# Altium project uz_d_iepe.PrjPCB (part 2 of 3)

## Sheet Power_3.SchDoc
size A4; CompanyName: TH Nürnberg; Organization: UltraZohm; Address1: Kesslerplatz 12; Address2: 90489 Nürnberg; Address3: GERMANY; SheetNumber: 7; SheetTotal: 10
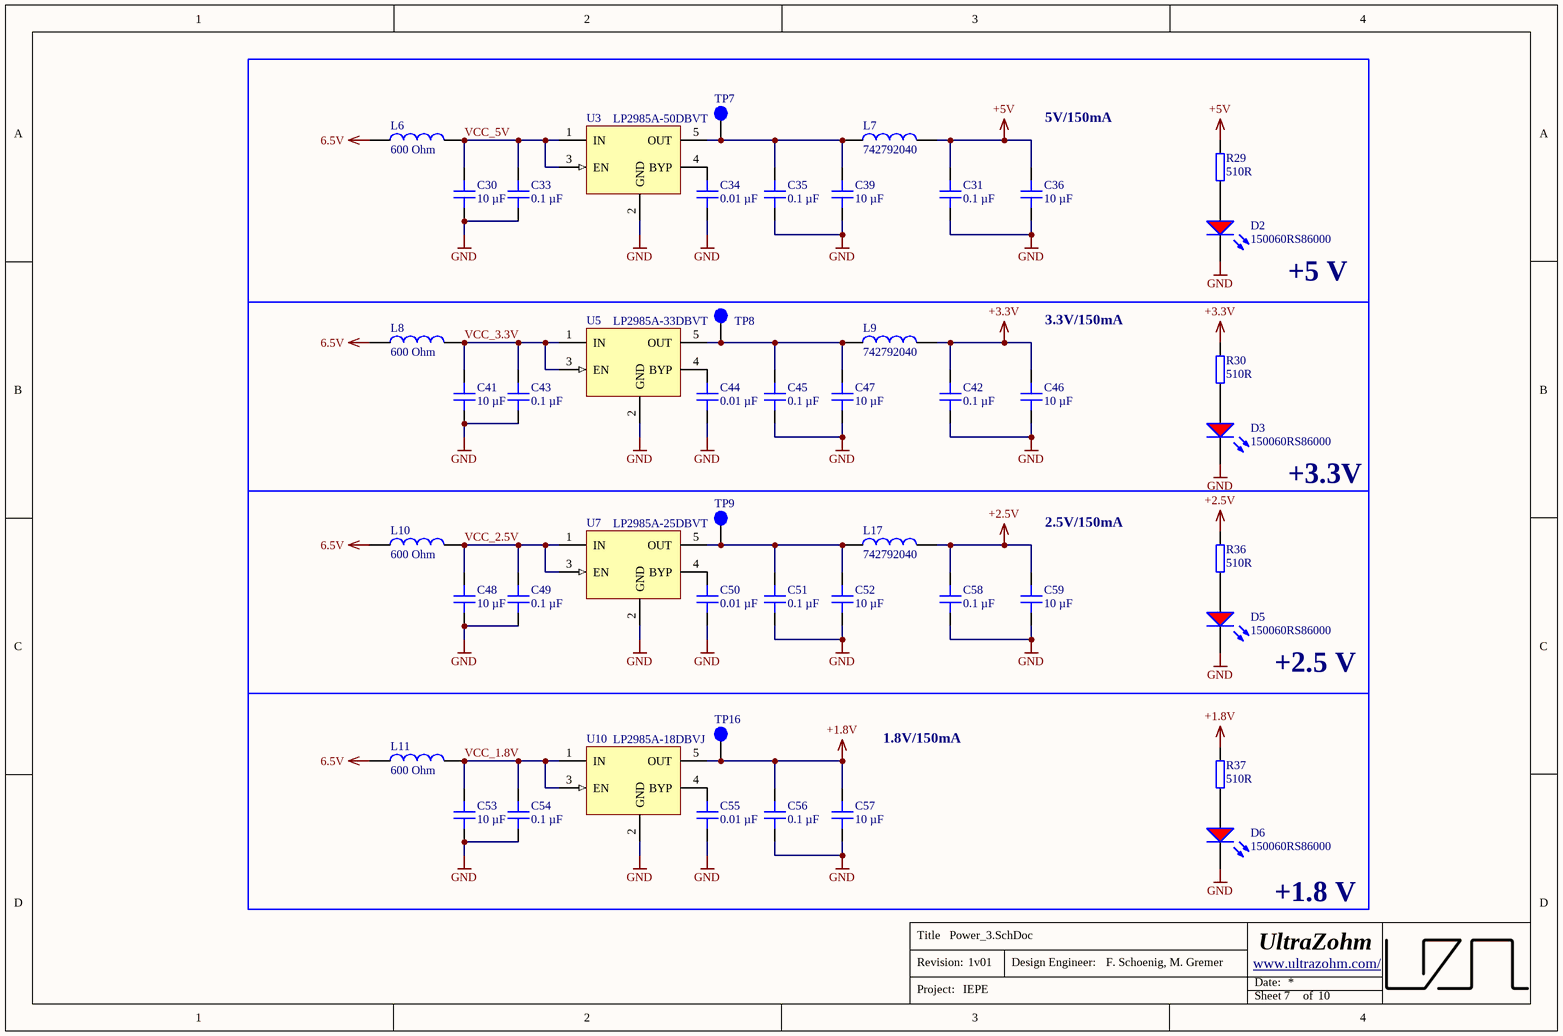
[diagram p5: Power_3.SchDoc]

### Parts
(Parts that share a designator on the sheet are numbered #1, #2 ... from top to bottom, then left to right.)
C30  10 µF  [C_1206]
C31  0.1 µF  [C_0603]
C33  0.1 µF  [C_0603]
C34  0.01 µF  [C_0603]
C35  0.1 µF  [C_0603]
C36  10 µF  [C_1206]
C39  10 µF  [C_1206]
C41  10 µF  [C_1206]
C42  0.1 µF  [C_0603]
C43  0.1 µF  [C_0603]
C44  0.01 µF  [C_0603]
C45  0.1 µF  [C_0603]
C46  10 µF  [C_1206]
C47  10 µF  [C_1206]
C48  10 µF  [C_1206]
C49  0.1 µF  [C_0603]
C50  0.01 µF  [C_0603]
C51  0.1 µF  [C_0603]
C52  10 µF  [C_1206]
C53  10 µF  [C_1206]
C54  0.1 µF  [C_0603]
C55  0.01 µF  [C_0603]
C56  0.1 µF  [C_0603]
C57  10 µF  [C_1206]
C58  0.1 µF  [C_0603]
C59  10 µF  [C_1206]
D2  150060RS86000  [WL-SMCW_0603]
D3  150060RS86000  [WL-SMCW_0603]
D5  150060RS86000  [WL-SMCW_0603]
D6  150060RS86000  [WL-SMCW_0603]
L6  600 Ohm  [WE-CBF_0805_High Current]
L7  742792040  [WE-CBF_0805_High Current]
L8  600 Ohm  [WE-CBF_0805_High Current]
L9  742792040  [WE-CBF_0805_High Current]
L10  600 Ohm  [WE-CBF_0805_High Current]
L11  600 Ohm  [WE-CBF_0805_High Current]
L17  742792040  [WE-CBF_0805_High Current]
R29  510R  [RES 0603_1608]
R30  510R  [RES 0603_1608]
R36  510R  [RES 0603_1608]
R37  510R  [RES 0603_1608]
TP7  -  [TP_1mm]  (value not drawn)
TP8  -  [TP_1mm]  (value not drawn)
TP9  -  [TP_1mm]  (value not drawn)
TP16  -  [TP_1mm]  (value not drawn)
U3#2  LP2985A-50DBVT  [SOT95P250X110-5N]
U5  LP2985A-33DBVT  [SOT95P250X110-5N]
U7  LP2985A-25DBVT  [SOT95P250X110-5N]
U10  LP2985A-18DBVJ  [SOT95P250X110-5N]

### Blocks framed on the sheet
+5 V: C30 C31 C33-C36 C39 D2 L6 L7 R29 TP7 U3#2

### Nets
6.5V: L6.1 L8.1 L10.1 L11.1
+1.8V: C56.2 C57.2 R37.2 TP16.1 U10.5(OUT)
+2.5V: C58.2 C59.2 L17.2 R36.2
+3.3V: C42.2 C46.2 L9.2 R30.2
+5V: C31.2 C36.2 L7.2 R29.2
GND: C30.1 C31.1 C33.1 C34.1 C35.1 C36.1 C39.1 C41.1 C42.1 C43.1 C44.1 C45.1 C46.1 C47.1 C48.1 C49.1 C50.1 C51.1 C52.1 C53.1 C54.1 C55.1 C56.1 C57.1 C58.1 C59.1 D2.1(K) D3.1(K) D5.1(K) D6.1(K) U3#2.2(GND) U5.2(GND) U7.2(GND) U10.2(GND)
VCC_1.8V: C53.2 C54.2 L11.2 U10.1(IN) U10.3(EN)
VCC_2.5V: C48.2 C49.2 L10.2 U7.1(IN) U7.3(EN)
VCC_3.3V: C41.2 C43.2 L8.2 U5.1(IN) U5.3(EN)
VCC_5V: C30.2 C33.2 L6.2 U3#2.1(IN) U3#2.3(EN)
NetC34_2: C34.2 U3#2.4(BYP)
NetC35_2: C35.2 C39.2 L7.1 TP7.1 U3#2.5(OUT)
NetC44_2: C44.2 U5.4(BYP)
NetC45_2: C45.2 C47.2 L9.1 TP8.1 U5.5(OUT)
NetC50_2: C50.2 U7.4(BYP)
NetC51_2: C51.2 C52.2 L17.1 TP9.1 U7.5(OUT)
NetC55_2: C55.2 U10.4(BYP)
NetD2_2: D2.2(A) R29.1
NetD3_2: D3.2(A) R30.1
NetD5_2: D5.2(A) R36.1
NetD6_2: D6.2(A) R37.1

### Notes on the sheet
- 5V/150mA
- 3.3V/150mA
- +3.3V
- 2.5V/150mA
- +2.5 V
- 1.8V/150mA
- +1.8 V
- Title
- Revision:
- Design Engineer:
- Date:
- Project:
- Sheet
- of

### Library data of the parts
C30 C36 C39 C41 C46-C48 C52 C53 C57 C59 = C1206C106J3RACAUTO: Capacitor 1206, 25 VDC, 10 µF, X7R; Manufacturer: KEMET; Tolerance: 5 %; Voltage Rating: 25 VDC; Created from: MGremer; Manufacturer Part Number: C1206C106J3RACAUTO; PartID: 24; Created On: 20.12.2020 13:54:13; ComponentLink1Description: Datasheet; ComponentLink1URL: https://www.mouser.de/datasheet/2/212/KEM_C1023_X7R_AUTO_SMD-1093309.pdf; Component Type: Capacitor 1206; Device Package: 1206; Last Updated: 20.12.2020 16:34:30; Mounting Type: SMD; Operating Temperature: -55 - 125°C; Series: SMD Auto X7R; Supplier 1: Mouser; Supplier Part Number 1: 80-C1206C106J3RAUTO; Type: Capacitor; Value: 10 µF; Live Cycle Status: 1; Stock number: Labor SMD Container
C31 C33 C35 C42 C43 C45 C49 C51 C54 C56 C58 = C0603X104K5RAC7411: Capacitor 0603, 50 VDC, 0.1 µF, X7R; Manufacturer: KEMET; Tolerance: 10 %; Voltage Rating: 50 VDC; Created from: MGremer; Manufacturer Part Number: C0603X104K5RAC7411; PartID: 3; Created On: 20.12.2020 13:54:13; ComponentLink1Description: Datasheet; ComponentLink1URL: https://www.mouser.de/datasheet/2/212/1/KEM_C1013_X7R_FT_CAP_SMD-1103280.pdf; Component Type: Capacitor 0603; Device Package: 0603; Last Updated: 04.03.2021 09:24:28; Mounting Type: SMD; Operating Temperature: -55 - 125°C; Series: SMD Comm X7R Flex; Supplier 1: Mouser; Supplier Part Number 1: 80-C0603X104K5R7411; Supplier 2: LCSC; Supplier Part Number 2: C14663; Type: Capacitor; Value: 0.1 µF; Live Cycle Status: 1; LCSC Part Number: C14663; Stock number: Labor SMD Container
C34 C44 C50 C55 = GCJ188R71H103KA01D: Capacitor 0603, 50 VDC, 0.01 µF, X7R; Manufacturer: muRata; Tolerance: 10 %; Voltage Rating: 50 VDC; Created from: MGremer; Manufacturer Part Number: GCJ188R71H103KA01D; PartID: 1; Created On: 20.12.2020 13:54:13; ComponentLink1Description: Datasheet; ComponentLink1URL: https://www.mouser.de/datasheet/2/281/c03e-516224.pdf; Component Type: Capacitor 0603; Device Package: 0603; Last Updated: 20.12.2020 16:24:16; Mounting Type: SMD; Operating Temperature: -55 - 125°C; Series: GCJ; Supplier 1: Mouser; Supplier Part Number 1: 81-GCJ188R71H103KA1D; Type: Capacitor; Value: 0.01 µF; Live Cycle Status: 1; Stock number: Labor SMD Container
D2 D3 D5 D6 = 150060RS86000: WL-SMCW SMD Mono-color Chip LED Waterclear Red; Manufacturer: Wuerth Elektronik; Type: Standard; Created from: MGremer; Forward Current I_f: 20 mA; Forward Voltage U_f: 2 V; Wavelength: 624 nm; Light Intensity: 800 mcd; Nominal Power: 48 mW; Manufacturer Part Number: 150060RS86000; PartID: 3; Created On: 08.12.2020 10:48:12; ComponentLink1Description: Datasheet; ComponentLink1URL: https://www.mouser.de/datasheet/2/445/150120RS75000-1714636.pdf; Component Type: LED Diode; Device Package: 0603; Last Updated: 03.03.2021 09:59:52; Mounting Type: SMD; Operating Temperature: -40 - 85 °C; Supplier 1: Mouser; Supplier Part Number 1: 710-150060RS86000; Supplier 2: Farnell; Supplier Part Number 2: 3408608; Supplier 3: Digi-Key; Supplier Part Number 3: 732-150060RS86000CT-ND; Live Cycle Status: 1; Stock number: not stored; Color: red
L6 L8 L10 L11 = 742792040: Inductance, 0805, 100 MHz, 600 Ohm, 2 A; Manufacturer: Wurth Elektronik; Type: Inductance SMD; DC current: 2 A; Created from: MGremer; Manufacturer Part Number: 742792040; PartID: 1; Created On: 18.01.2021 14:53:17; ComponentLink1Description: Datasheet; ComponentLink1URL: https://www.mouser.de/datasheet/2/445/742792040-1720361.pdf; Component Type: Inductance; Device Package: 0805; Last Updated: 18.01.2021 14:53:25; Mounting Type: SMD; Operating Temperature: -55 - 125 °C; Series: WE-CBF; Supplier 1: Mouser; Supplier Part Number 1: 710-742792040; Value: 600 Ohm; Live Cycle Status: 1; Stock number: not stored
L7 L9 L17 = 742792040: Inductance, 0805, 100 MHz, 600 Ohm, 2 A; Manufacturer: Wurth Elektronik; Type: Inductance SMD; DC current: 2 A; Value: 600 Ohm; Created from: MGremer; Manufacturer Part Number: 742792040; PartID: 1; Created On: 18.01.2021 14:53:17; ComponentLink1Description: Datasheet; ComponentLink1URL: https://www.mouser.de/datasheet/2/445/742792040-1720361.pdf; Component Type: Inductance; Device Package: 0805; Last Updated: 18.01.2021 14:53:25; Mounting Type: SMD; Operating Temperature: -55 - 125 °C; Series: WE-CBF; Supplier 1: Mouser; Supplier Part Number 1: 710-742792040; Live Cycle Status: 1; Stock number: not stored
R29 R30 R36 R37 = RK73B1JTTD511J: SMD resistor E24 series; Manufacturer: KOA Speer; Tolerance: 5%; Created from: MGremer; Manufacturer Part Number: RK73B1JTTD511J; PartID: 67; Created On: 14.12.2020 16:17:14; ComponentLink1Description: Datasheet; ComponentLink1URL: https://www.mouser.de/datasheet/2/219/RK73B-1825463.pdf; Component Type: SMD resistor; Device Package: 0603; Last Updated: 02.03.2021 14:07:32; Mounting Type: SMD; Supplier 1: Mouser; Supplier Part Number 1: 660-RK73B1JTTD511J; Type: Resistor; Value: 510R; Live Cycle Status: 1; Stock number: Labor SMD Container
TP7-TP9 TP16 = -: Test Point 1 mm; Value: TP; Created from: MGremer; Created: 2018_06_25_AGeiger; Manufacturer Part Number: -; PartID: 9; Created On: 02.03.2021 14:59:37; ComponentLink1Description: Datasheet; ComponentLink1URL: -; ComponentLink2Description: Homepage; ComponentLink2URL: -; Component Type: Test Point; Device Package: SMD; Last Updated: 08.10.2021 21:16:06; Manufacturer: -; Minimum Order: 1; Mounting Type: SMD; Supplier 1: -; Supplier Part Number 1: -; Type: Test point; Live Cycle Status: 1; Stock number: not stored
U3#2 = LP2985A-50DBVT: 150 mA Low-noise Low-dropout regulator with shutdown; fixed 5 V output; MPN: LP2985A-25; MF: Texas Instruments; Value: 5 V; Created from: MGremer; Supplier 1: Mouser; Supplier Part Number 1: 595-LP2985A-50DBVT; Package: SOT-23-5; ComponentLink1Description: Datasheet; ComponentLink1URL: https://www.ti.com/lit/ds/symlink/lp2985a.pdf?HQS=dis-mous-null-mousermode-dsf-pf-null-wwe&ts=1629794945152; ComponentLink2Description: Datasheet; ComponentLink2URL: https://www.ti.com/lit/ds/symlink/lp2985a.pdf; Manufacturer Part Number: LP2985A-50DBVT; PartID: 4; Created On: 24.08.2021 11:34:06; Component Type: LDO; Device Package: SMD; Last Updated: 24.08.2021 11:44:26; Manufacturer: Texas Instruments; Mounting Type: SMD; Operating Temperature: -40 - 125 °C; Series: LP2985A-50; Type: LDO; Live Cycle Status: 1; Stock number: not stored
U5 = LP2985A-33DBVT: 150 mA Low-noise Low-dropout regulator with shutdown; fixed 3.3 V output; MPN: LP2985A-25; MF: Texas Instruments; Value: 3.3 V; Created from: MGremer; Supplier 1: Mouser; Supplier Part Number 1: 595-LP2985A-33DBVT; Package: SOT-23-5; ComponentLink1Description: Datasheet; ComponentLink1URL: https://www.ti.com/lit/ds/symlink/lp2985a.pdf?HQS=dis-mous-null-mousermode-dsf-pf-null-wwe&ts=1629794945152; ComponentLink2Description: Datasheet; ComponentLink2URL: https://www.ti.com/lit/ds/symlink/lp2985a.pdf; Manufacturer Part Number: LP2985A-33DBVT; PartID: 3; Created On: 24.08.2021 11:34:06; Component Type: LDO; Device Package: SMD; Last Updated: 24.08.2021 11:39:57; Manufacturer: Texas Instruments; Mounting Type: SMD; Operating Temperature: -40 - 125 °C; Series: LP2985A-25; Type: LDO; Live Cycle Status: 1; Stock number: not stored
U7 = LP2985A-25DBVT: 150 mA Low-noise Low-dropout regulator with shutdown; fixed 2.5 V output; MF: Texas Instruments; Value: 2.5 V; Created from: MGremer; MPN: LP2985A-25; Supplier 1: Mouser; Supplier Part Number 1: 595-LP2985A-25DBVT; Package: SOT-23-5; ComponentLink1Description: Datasheet; ComponentLink1URL: https://www.ti.com/lit/ds/symlink/lp2985a.pdf?HQS=dis-mous-null-mousermode-dsf-pf-null-wwe&ts=1629794945152; ComponentLink2Description: Datasheet; ComponentLink2URL: https://www.ti.com/lit/ds/symlink/lp2985a.pdf; Manufacturer Part Number: LP2985A-25DBVT; PartID: 2; Created On: 24.08.2021 11:34:06; Component Type: LDO; Device Package: SMD; Last Updated: 24.08.2021 11:39:57; Manufacturer: Texas Instruments; Mounting Type: SMD; Operating Temperature: -40 - 125 °C; Series: LP2985A-25; Type: LDO; Live Cycle Status: 1; Stock number: not stored
U10 = LP2985A-18DBVJ: 150 mA Low-noise Low-dropout regulator with shutdown; Manufacturer 1: Texas Instruments; Created from: MGremer; Supplier 1: Mouser; Supplier Part Number 1: 595-LP2985A-18DBVJ; Package: SOT-23-5; ComponentLink1Description: Datasheet; ComponentLink1URL: https://www.ti.com/general/docs/suppproductinfo.tsp?distId=26&gotoUrl=http%3A%2F%2Fwww.ti.com%2Flit%2Fgpn%2Flp2985a; ComponentLink2Description: Datasheet; ComponentLink2URL: https://www.ti.com/lit/ds/symlink/lp2985a.pdf; Manufacturer Part Number 1: LP2985A-18; Manufacturer Part Number: LP2985A-18DBVJ; PartID: 1; Created On: 24.08.2021 11:34:06; Component Type: LDO; Device Package: SMD; Last Updated: 24.08.2021 11:34:06; Manufacturer: Texas Instruments; Mounting Type: SMD; Operating Temperature: -40 - 125 °C; Series: LP2985A-18; Type: LDO; Live Cycle Status: 1; Stock number: not stored

## Sheet ADC_Ref.SchDoc
size A4; CompanyName: TH Nürnberg; Organization: UltraZohm; Address1: Kesslerplatz 12; Address2: 90489 Nürnberg; Address3: GERMANY; SheetNumber: 8; SheetTotal: 10
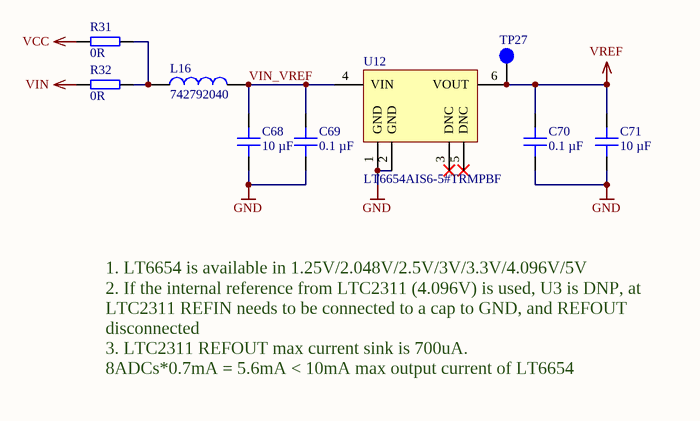
[diagram p6: ADC_Ref.SchDoc]

### Parts
C68  10 µF  [C_1206]
C69  0.1 µF  [C_0603]
C70  0.1 µF  [C_0603]
C71  10 µF  [C_1206]
L16  742792040  [WE-CBF_0805_High Current]
R31  0R  [RES 0603_1608]
R32  0R  [RES 0603_1608]
TP27  -  [TP_1mm]  (value not drawn)
U12  LT6654AIS6-5#TRMPBF  [SOT95P280X100-6N]

### Nets
GND: C68.1 C69.1 C70.1 C71.1 U12.1(GND) U12.2(GND)
VCC: R31.1
VIN: R32.1
VREF: C70.2 C71.2 TP27.1 U12.6(VOUT)
VIN_VREF: C68.2 C69.2 L16.2 U12.4(VIN)
NetL16_1: L16.1 R31.2 R32.2

Not connected (* = marked no-connect by the designer): U12 3(DNC)* 5(DNC)*

### Notes on the sheet
- 1. LT6654 is available in 1.25V/2.048V/2.5V/3V/3.3V/4.096V/5V
  2. If the internal reference from LTC2311 (4.096V) is used, U3 is DNP, at LTC2311 REFIN needs to be connected to a cap to GND, and REFOUT disconnected
  3. LTC2311 REFOUT max current sink is 700uA.
  8ADCs*0.7mA = 5.6mA < 10mA max output current of LT6654
- Title
- Revision:
- Design Engineer:
- Date:
- Project:
- Sheet
- of

### Library data of the parts
C68 C71 = 1206DD106MAT2A: Capacitor 1206, 35 VDC, 10 µF, X5R; Manufacturer: AVX; Tolerance: 20%; Voltage Rating: 35 VDC; Created from: MGremer; Manufacturer Part Number: 1206DD106MAT2A; PartID: 49; Created On: 20.12.2020 13:54:13; ComponentLink1Description: Datasheet; ComponentLink1URL: https://www.mouser.de/datasheet/2/40/cx5r-776519.pdf; Component Type: Capacitor 1206; Device Package: 1206; Last Updated: 20.12.2020 17:44:37; Mounting Type: SMD; Operating Temperature: -55 - 85°C; Series: X5R; Supplier 1: Mouser; Supplier Part Number 1: 581-1206DD106MAT2A; Type: Capacitor; Value: 10 µF; Live Cycle Status: 1; Stock number: not stored
C69 C70 = C0603X104K5RAC7411: as C31 on sheet Power_3; Manufacturer Part Number: C0603X104K5RAC7411; PartID: 3; Created On: 20.12.2020 13:54:13; ComponentLink1Description: Datasheet; ComponentLink1URL: https://www.mouser.de/datasheet/2/212/1/KEM_C1013_X7R_FT_CAP_SMD-1103280.pdf; Component Type: Capacitor 0603; Device Package: 0603; Last Updated: 04.03.2021 09:24:28; Mounting Type: SMD; Operating Temperature: -55 - 125°C; Series: SMD Comm X7R Flex; Supplier 1: Mouser; Supplier Part Number 1: 80-C0603X104K5R7411; Supplier 2: LCSC; Supplier Part Number 2: C14663; Type: Capacitor; Value: 0.1 µF; Live Cycle Status: 1; LCSC Part Number: C14663; Stock number: Labor SMD Container
L16 = 742792040: as L7 on sheet Power_3; Manufacturer Part Number: 742792040; PartID: 1; Created On: 18.01.2021 14:53:17; ComponentLink1Description: Datasheet; ComponentLink1URL: https://www.mouser.de/datasheet/2/445/742792040-1720361.pdf; Component Type: Inductance; Device Package: 0805; Last Updated: 18.01.2021 14:53:25; Mounting Type: SMD; Operating Temperature: -55 - 125 °C; Series: WE-CBF; Supplier 1: Mouser; Supplier Part Number 1: 710-742792040; Live Cycle Status: 1; Stock number: not stored
R31 R32 = RC0603JR-070RL: SMD resistor E24 series; Manufacturer: YAGEO; Tolerance: 5%; Created from: MGremer; Manufacturer Part Number: RC0603JR-070RL; PartID: 1; Created On: 14.12.2020 16:17:14; ComponentLink1Description: Datasheet; ComponentLink1URL: https://www.mouser.de/datasheet/2/447/PYu-RC_Group_51_RoHS_L_10-1664068.pdf; Component Type: SMD resistor; Device Package: 0603; Last Updated: 04.03.2021 09:09:42; Mounting Type: SMD; Supplier 1: Mouser; Supplier Part Number 1: 603-RC0603JR-070RL; Supplier 2: LCSC; Supplier Part Number 2: C21189; Type: Resistor; Value: 0R; Live Cycle Status: 1; Stock number: Labor SMD Container; LCSC Part Number: C21189
TP27 = -: as TP7 on sheet Power_3; Created: 2018_06_25_AGeiger; Manufacturer Part Number: -; PartID: 9; Created On: 02.03.2021 14:59:37; ComponentLink1Description: Datasheet; ComponentLink1URL: -; ComponentLink2Description: Homepage; ComponentLink2URL: -; Component Type: Test Point; Device Package: SMD; Last Updated: 08.10.2021 21:16:06; Manufacturer: -; Minimum Order: 1; Mounting Type: SMD; Supplier 1: -; Supplier Part Number 1: -; Type: Test point; Live Cycle Status: 1; Stock number: not stored
U12 = LT6654AIS6-5#TRMPBF: Precision Wide Supply High Output Drive Low Noise Reference, 5 V; Manufacturer: Analog Devices; Value: 5 V; Created from: MGremer; Manufacturer Part Number: LT6654AIS6-5#TRMPBF; PartID: 9; Created On: 06.01.2021 09:48:37; ComponentLink1Description: Datasheet; ComponentLink1URL: https://www.mouser.de/datasheet/2/609/6654fh-1266957.pdf; Component Type: Precision Wide Supply; Device Package: -; Last Updated: 15.02.2021 10:14:22; Mounting Type: SMD; Operating Temperature: -40 - 85 °C; Series: LT6654; Supplier 1: Mouser; Supplier Part Number 1: 584-6654AIS65TRMPBF; Type: Precision Wide Supply; Live Cycle Status: 1; Stock number: not stored

## Sheet I2C.SchDoc
size A4; CompanyName: TH Nürnberg; Organization: UltraZohm; Address1: Kesslerplatz 12; Address2: 90489 Nürnberg; Address3: GERMANY; SheetNumber: 9; SheetTotal: 10
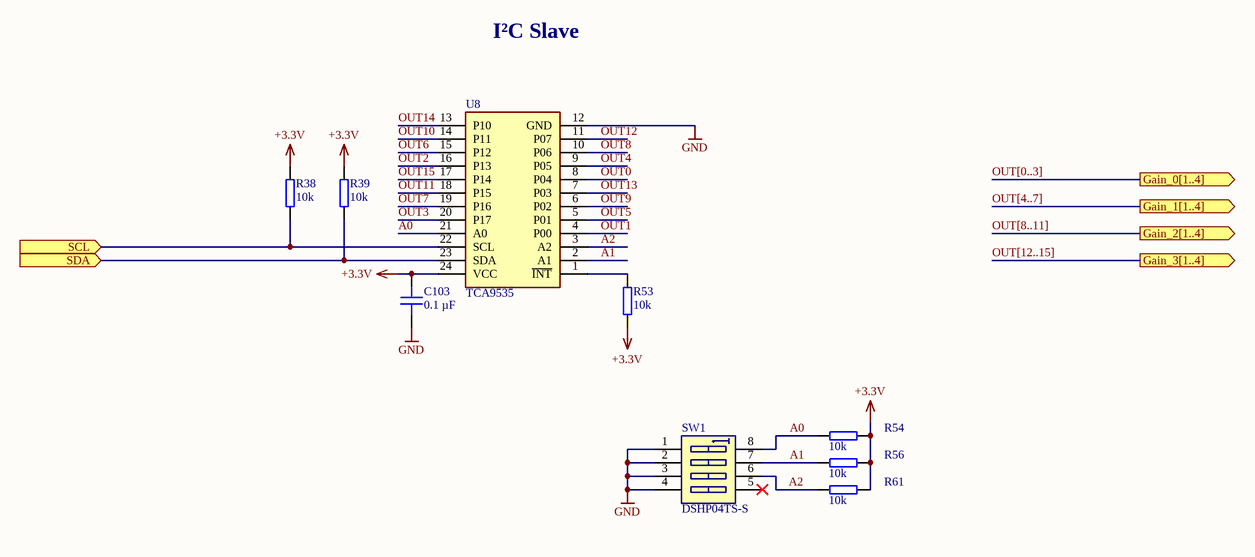
[diagram p7: I2C.SchDoc]

### Parts
C103  0.1 µF  [C_0603]
R38  10k  [RES 0603_1608]
R39  10k  [RES 0603_1608]
R53  10k  [RES 0603_1608]
R54  10k  [RES 0603_1608]
R56  10k  [RES 0603_1608]
R61  10k  [RES 0603_1608]
SW1  DSHP04TS-S  [416131160804]
U8  TCA9535  [SOP65P640X120-24N]

### Ports
Gain_0[1..4] (out), Gain_1[1..4] (out), Gain_2[1..4] (out), Gain_3[1..4] (out), SCL (in), SDA (in)

### Nets
+3.3V: C103.2 R38.2 R39.2 R53.1 R54.1 R56.1 R61.1 U8.24(VCC)
GND: C103.1 SW1.1 SW1.2 SW1.3 SW1.4 U8.12(GND)
A0: R54.2 SW1.8 U8.21(A0)
A1: R56.2 SW1.7 U8.2(A1)
A2: R61.2 SW1.6 U8.3(A2)
OUT0: U8.8(P04)  [project net Gain_01]
OUT1: U8.4(P00)  [project net Gain_02]
OUT2: U8.16(P13)  [project net Gain_03]
OUT3: U8.20(P17)  [project net Gain_04]
OUT4: U8.9(P05)  [project net Gain_11]
OUT5: U8.5(P01)  [project net Gain_12]
OUT6: U8.15(P12)  [project net Gain_13]
OUT7: U8.19(P16)  [project net Gain_14]
OUT8: U8.10(P06)  [project net Gain_21]
OUT9: U8.6(P02)  [project net Gain_22]
OUT10: U8.14(P11)  [project net Gain_23]
OUT11: U8.18(P15)  [project net Gain_24]
OUT12: U8.11(P07)  [project net Gain_31]
OUT13: U8.7(P03)  [project net Gain_32]
OUT14: U8.13(P10)  [project net Gain_33]
OUT15: U8.17(P14)  [project net Gain_34]
SCL: R38.1 U8.22(SCL) ; port SCL
SDA: R39.1 U8.23(SDA) ; port SDA
NetR53_2: R53.2 U8.1(~{INT})

Not connected (* = marked no-connect by the designer): SW1 5*

### Buses and harness runs
bus OUT[0..3] = port Gain_0[1..4]
bus OUT[4..7] = port Gain_1[1..4]
bus OUT[8..11] = port Gain_2[1..4]
bus OUT[12..15] = port Gain_3[1..4]

### Notes on the sheet
- I²C Slave
- Title
- Revision:
- Design Engineer:
- Date:
- Project:
- Sheet
- of

### Library data of the parts
C103 = C0603C104J3REC7411: Capacitor 0603, 25 VDC, 0.1 µF, X7R; Manufacturer: KEMET; Tolerance: 5 %; Voltage Rating: 25 VDC; Created from: MGremer; Manufacturer Part Number: C0603C104J3REC7411; PartID: 2; Created On: 20.12.2020 13:54:13; ComponentLink1Description: Datasheet; ComponentLink1URL: https://www.mouser.de/datasheet/2/212/1/KEM_C1090_X7R_ESD-1103328.pdf; Component Type: Capacitor 0603; Device Package: 0603; Last Updated: 20.12.2020 16:43:29; Mounting Type: SMD; Operating Temperature: -55 - 125°C; Series: ESD SMD Auto X7R; Supplier 1: Mouser; Supplier Part Number 1: 80-C0603C104J3RE7411; Type: Capacitor; Value: 0.1 µF; Live Cycle Status: 1; Stock number: Labor SMD Container
R38 R39 R53 R54 R56 R61 = RK73B1JTTD103J: SMD resistor E24 series; Manufacturer: KOA Speer; Tolerance: 5%; Created from: MGremer; Manufacturer Part Number: RK73B1JTTD103J; PartID: 98; Created On: 14.12.2020 16:17:14; ComponentLink1Description: Datasheet; ComponentLink1URL: https://www.mouser.de/datasheet/2/219/RK73B-1825463.pdf; Component Type: SMD resistor; Device Package: 0603; Last Updated: 02.03.2021 14:07:32; Mounting Type: SMD; Supplier 1: Mouser; Supplier Part Number 1: 660-RK73B1JTTD103J; Type: Resistor; Value: 10k; Live Cycle Status: 1; Stock number: Labor SMD Container
SW1 = DSHP04TS-S: 04p, 1.27mm Pitch, Horizontal, HP Type, SMT, flat Actuator, black, with Tape, T&R; Manufacturer: XKB Connectivity; Created from: T. Wendt; Manufacturer Part Number: DSHP04TS-S; PartID: 6; Created On: 02.03.2021 14:59:37; ComponentLink1Description: Datasheet; ComponentLink1URL: https://datasheet.lcsc.com/szlcsc/1912111437_XKB-Connectivity-DSHP04TS-S_C319050.pdf; Component Type: DIP-Switch; Device Package: DIP; Last Updated: 02.03.2021 14:59:37; Minimum Order: 1; Mounting Type: SMD; Supplier 1: LCSC; Supplier Part Number 1: C319050; Type: DIP-Switch; Live Cycle Status: 1; LCSC Part Number: C319050; Stock number: not stored
U8 = TCA9535: Low-Voltage 16-Bit I2C and SMBus Low-Power I/O Expander; Manufacturer_Name: Texas Instruments; Created from: PTurow; Datasheet Link: http://www.ti.com/lit/gpn/tca9535; Height: 1.2mm; Mouser2 Part Number: 595-TCA9535PWR; Mouser2 Price/Stock: https://www.mouser.com/Search/Refine.aspx?Keyword=595-TCA9535PWR; Manufacturer_Part_Number: TCA9535PWR; Manufacturer Part Number: TCA9535; PartID: 1; Created On: 20.05.2021 16:25:49; ComponentLink1Description: Datasheet; ComponentLink1URL: https://www.ti.com/lit/ds/symlink/tca9535.pdf?HQS=dis-mous-null-mousermode-dsf-pf-null-wwe&ts=1621337604488&ref_url=https%253A%252F%252Fwww.mouser.de%252F; Component Type: I2C-IO-Expander; Last Updated: 24.08.2021 11:10:15; Manufacturer: Texas Instruments; Mounting Type: SMD; Supplier 1: Mouser; Supplier Part Number 1: 595-TCA9535PWR; Type: I2C IO Expander; Live Cycle Status: 1; Stock number: not stored

## Sheet Power_1.SchDoc
size A4; CompanyName: TH Nürnberg; Organization: UltraZohm; Address1: Kesslerplatz 12; Address2: 90489 Nürnberg; Address3: GERMANY; SheetNumber: 10; SheetTotal: 10
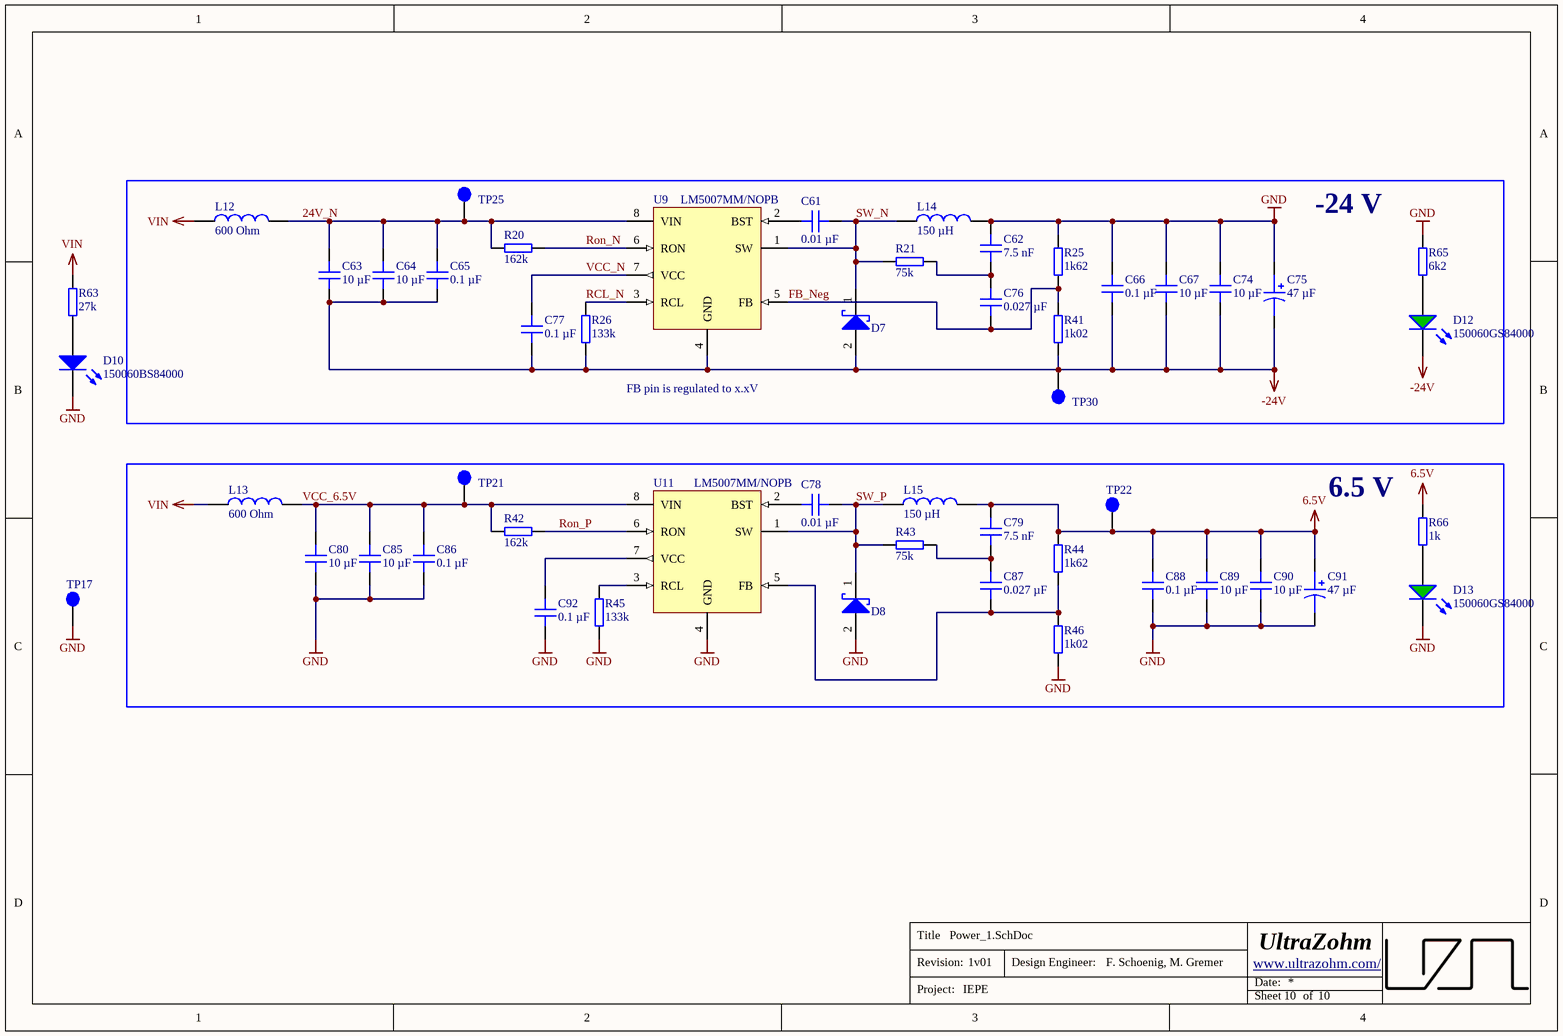
[diagram p8: Power_1.SchDoc]

### Parts
C61  0.01 µF  [C_0603]
C62  7.5 nF  [C_0603]
C63  10 µF  [C_1206]
C64  10 µF  [C_1206]
C65  0.1 µF  [C_0603]
C66  0.1 µF  [C_0603]
C67  10 µF  [C_1206]
C74  10 µF  [C_1206]
C75  47 µF  [CAPAE830X650N]
C76  0.027 µF  [C_0603]
C77  0.1 µF  [C_0603]
C78  0.01 µF  [C_0603]
C79  7.5 nF  [C_0603]
C80  10 µF  [C_1206]
C85  10 µF  [C_1206]
C86  0.1 µF  [C_0603]
C87  0.027 µF  [C_0603]
C88  0.1 µF  [C_0603]
C89  10 µF  [C_1206]
C90  10 µF  [C_1206]
C91  47 µF  [CAPAE830X650N]
C92  0.1 µF  [C_0603]
D7  BYS12-90-E3/TR3  [DIOM4227X23N]  (value not drawn)
D8  BYS12-90-E3/TR3  [DIOM4227X23N]  (value not drawn)
D10  150060BS84000  [WL-SMCW_0603]
D12  150060GS84000  [WL-SMCW_0603]
D13  150060GS84000  [WL-SMCW_0603]
L12  600 Ohm  [WE-CBF_0805_High Current]
L13  600 Ohm  [WE-CBF_0805_High Current]
L14  150 µH  [SMT_inductor_1050]
L15  150 µH  [SMT_inductor_1050]
R20  162k  [RES 0603_1608]
R21  75k  [RES 0603_1608]
R25  1k62  [RES 0603_1608]
R26  133k  [RES 0603_1608]
R41  1k02  [RES 0603_1608]
R42  162k  [RES 0603_1608]
R43  75k  [RES 0603_1608]
R44  1k62  [RES 0603_1608]
R45  133k  [RES 0603_1608]
R46  1k02  [RES 0603_1608]
R63  27k  [RES 0603_1608]
R65  6k2  [RES 0603_1608]
R66  1k  [RES 0603_1608]
TP17  -  [TP_1mm]  (value not drawn)
TP21  -  [TP_1mm]  (value not drawn)
TP22  -  [TP_1mm]  (value not drawn)
TP25  -  [TP_1mm]  (value not drawn)
TP30  -  [TP_1mm]  (value not drawn)
U9  LM5007MM/NOPB  [TSOP65P490X110-8N]
U11  LM5007MM/NOPB  [TSOP65P490X110-8N]

### Blocks framed on the sheet
-24 V: C61-C67 C74-C77 D7 D12 L12 L14 R20 R21 R25 R26 R41 R65 TP25 TP30 U9
6.5 V: C78-C80 C85-C92 D8 D13 L13 L15 R42-R46 R66 TP21 TP22 U11

### Nets
6.5V: C79.2 C88.2 C89.2 C90.2 C91.1 L15.2 R44.2 R66.2 TP22.1
-24V: C63.1 C64.1 C65.1 C66.1 C67.1 C74.1 C75.2 C77.1 D7.2(A) D12.1(K) R26.1 R41.1 TP30.1 U9.4(GND)
GND: C62.2 C66.2 C67.2 C74.2 C75.1 C80.1 C85.1 C86.1 C88.1 C89.1 C90.1 C91.2 C92.1 D8.2(A) D10.1(K) D13.1(K) L14.2 R25.2 R45.1 R46.1 R65.2 TP17.1 U11.4(GND)
VIN: L12.1 L13.1 R63.2
24V_N: C63.2 C64.2 C65.2 L12.2 R20.1 TP25.1 U9.8(VIN)
FB_Neg: C76.1 R25.1 R41.2 U9.5(FB)
RCL_N: R26.2 U9.3(RCL)
Ron_N: R20.2 U9.6(RON)
Ron_P: R42.2 U11.6(RON)
SW_N: C61.2 D7.1(K) L14.1 R21.1 U9.1(SW)
SW_P: C78.2 D8.1(K) L15.1 R43.1 U11.1(SW)
VCC_6.5V: C80.2 C85.2 C86.2 L13.2 R42.1 TP21.1 U11.8(VIN)
VCC_N: C77.2 U9.7(VCC)
NetC61_1: C61.1 U9.2(BST)
NetC62_1: C62.1 C76.2 R21.2
NetC78_1: C78.1 U11.2(BST)
NetC79_1: C79.1 C87.2 R43.2
NetC87_1: C87.1 R44.1 R46.2 U11.5(FB)
NetC92_2: C92.2 U11.7(VCC)
NetD10_2: D10.2(A) R63.1
NetD12_2: D12.2(A) R65.1
NetD13_2: D13.2(A) R66.1
NetR45_2: R45.2 U11.3(RCL)

### Notes on the sheet
- FB pin is regulated to x.xV
- Title
- Revision:
- Design Engineer:
- Date:
- Project:
- Sheet
- of

### Library data of the parts
C61 C78 = GCJ188R71H103KA01D: as C34 on sheet Power_3; Manufacturer Part Number: GCJ188R71H103KA01D; PartID: 1; Created On: 20.12.2020 13:54:13; ComponentLink1Description: Datasheet; ComponentLink1URL: https://www.mouser.de/datasheet/2/281/c03e-516224.pdf; Component Type: Capacitor 0603; Device Package: 0603; Last Updated: 20.12.2020 16:24:16; Mounting Type: SMD; Operating Temperature: -55 - 125°C; Series: GCJ; Supplier 1: Mouser; Supplier Part Number 1: 81-GCJ188R71H103KA1D; Type: Capacitor; Value: 0.01 µF; Live Cycle Status: 1; Stock number: Labor SMD Container
C62 C79 = C0603C752J3GACTU: Capacitor 0603, 25 VDC, 7.5 nF, C0G; Manufacturer: KEMET; Tolerance: 5 %; Voltage Rating: 25 VDC; Created from: MGremer; Manufacturer Part Number: C0603C752J3GACTU; PartID: 52; Created On: 20.12.2020 13:54:13; ComponentLink1Description: Datasheet; ComponentLink1URL: https://www.mouser.de/datasheet/2/212/KEM_C1003_C0G_SMD-1101588.pdf; Component Type: Capacitor 0603; Device Package: 0603; Last Updated: 20.12.2020 16:43:29; Mounting Type: SMD; Operating Temperature: -55 - 125°C; Series: SMD Comm C0G; Supplier 1: Mouser; Supplier Part Number 1: 80-C0603C752J3GACTU; Type: Capacitor; Value: 7.5 nF; Live Cycle Status: 1; Stock number: not stored
C63 C64 C67 C74 C80 C85 C89 C90 = 1206DD106MAT2A: as C68 on sheet ADC_Ref; Manufacturer Part Number: 1206DD106MAT2A; PartID: 49; Created On: 20.12.2020 13:54:13; ComponentLink1Description: Datasheet; ComponentLink1URL: https://www.mouser.de/datasheet/2/40/cx5r-776519.pdf; Component Type: Capacitor 1206; Device Package: 1206; Last Updated: 20.12.2020 17:44:37; Mounting Type: SMD; Operating Temperature: -55 - 85°C; Series: X5R; Supplier 1: Mouser; Supplier Part Number 1: 581-1206DD106MAT2A; Type: Capacitor; Value: 10 µF; Live Cycle Status: 1; Stock number: not stored
C65 C66 C77 C86 C88 C92 = C0603X104K5RAC7411: as C31 on sheet Power_3; Manufacturer Part Number: C0603X104K5RAC7411; PartID: 3; Created On: 20.12.2020 13:54:13; ComponentLink1Description: Datasheet; ComponentLink1URL: https://www.mouser.de/datasheet/2/212/1/KEM_C1013_X7R_FT_CAP_SMD-1103280.pdf; Component Type: Capacitor 0603; Device Package: 0603; Last Updated: 04.03.2021 09:24:28; Mounting Type: SMD; Operating Temperature: -55 - 125°C; Series: SMD Comm X7R Flex; Supplier 1: Mouser; Supplier Part Number 1: 80-C0603X104K5R7411; Supplier 2: LCSC; Supplier Part Number 2: C14663; Type: Capacitor; Value: 0.1 µF; Live Cycle Status: 1; LCSC Part Number: C14663; Stock number: Labor SMD Container
C75 C91 = EEE-1VA470P: Capacitor, 47µF, 35VDC Al Electrolyt; Manufacturer: Panasonic; Tolerance: 20 %; Created from: T. Wendt; Manufacturer Part Number: EEE-1VA470P; PartID: 63; Created On: 26.02.2021 15:32:07; ComponentLink1Description: Datasheet; ComponentLink1URL: https://industrial.panasonic.com/cdbs/www-data/pdf/RDE0000/ABA0000C1145.pdf; Component Type: Capacitor Al Electrolyt; Last Updated: 04.03.2021 09:24:01; Mounting Type: SMD; Operating Temperature: -40 - 85°C; Series: S Series; Supplier 1: Mouser; Supplier Part Number 1: 667-EEE-1VA470P; Supplier 2: LCSC; Supplier Part Number 2: C336247; Type: Capacitor; Voltage Rating: 35 VDC; Value: 47 µF; Live Cycle Status: 1; LCSC Part Number: C336247; Stock number: not stored
C76 C87 = 06035C273J4T2A: Capacitor 0603, 50 VDC, 27 nF, X7R; Manufacturer: AVX; Tolerance: 5 %; Voltage Rating: 50 VDC; Created from: MGremer; Manufacturer Part Number: 06035C273J4T2A; PartID: 81; Created On: 20.12.2020 13:54:13; ComponentLink1Description: Datasheet; ComponentLink1URL: https://www.mouser.de/datasheet/2/40/AutoMLCC-777028.pdf; Component Type: Capacitor 0603; Device Package: 0603; Last Updated: 20.01.2021 13:57:36; Mounting Type: SMD; Operating Temperature: -55 - 125°C; Series: AutoMLCC X7R; Supplier 1: Mouser; Supplier Part Number 1: 581-06035C273J4T2A; Type: Capacitor; Value: 0.027 µF; Live Cycle Status: 1; Stock number: not stored
D7 D8 = BYS12-90-E3/TR3: Schottky Rectifier, 1.5 A, 90 V; Manufacturer: Vishay General Semiconductor; Forward Current: 1.5 A; Forward Voltage: 0.75 V; Reverse Current: 100 µA; Created from: MGremer; Manufacturer Part Number: BYS12-90-E3/TR3; PartID: 2; Created On: 06.01.2021 14:34:10; ComponentLink1Description: Datasheet; ComponentLink1URL: https://www.mouser.de/datasheet/2/427/bys12_90-1768074.pdf; Component Type: Schottky Rectifier; Device Package: SMA; Last Updated: 18.01.2021 16:09:20; Mounting Type: SMD; Operating Temperature: -55 - 150 °C; Supplier 1: Mouser; Supplier Part Number 1: 625-BYS12-90-E3/TR3; Type: Schottky Rectifier; Value: -; Live Cycle Status: 1; Stock number: not stored
D10 = 150060BS84000: WL-SMCW SMD Mono-color Chip LED Waterclear Blue; Manufacturer: Wuerth Elektronik; Type: Standard; Created from: MGremer; Forward Current I_f: 20 mA; Forward Voltage U_f: 3.2 V; Wavelength: 470 nm; Light Intensity: 560 mcd; Nominal Power: 78 mW; Manufacturer Part Number: 150060BS84000; PartID: 1; Created On: 08.12.2020 10:19:38; ComponentLink1Description: Datasheet; ComponentLink1URL: https://www.mouser.de/datasheet/2/445/150060BS84000-1838909.pdf; Component Type: LED Diode; Device Package: 0603; Last Updated: 03.03.2021 09:59:51; Mounting Type: SMD; Operating Temperature: -40 - 85 °C; Supplier 1: Mouser; Supplier Part Number 1: 710-150060BS84000; Supplier 2: Farnell; Supplier Part Number 2: 3408611; Supplier 3: Digi-Key; Supplier Part Number 3: 732-150060BS84000CT-ND; Live Cycle Status: 1; Stock number: not stored; Color: blue
D12 D13 = 150060GS84000: WL-SMCW SMD Mono-color Chip LED Waterclear Green; Manufacturer: Wuerth Elektronik; Type: Standard; Created from: MGremer; Forward Current I_f: 20 mA; Forward Voltage U_f: 3.2 V; Wavelength: 525 nm; Light Intensity: 3000 mcd; Nominal Power: 78 mW; Manufacturer Part Number: 150060GS84000; PartID: 2; Created On: 08.12.2020 10:41:11; ComponentLink1Description: Datasheet; ComponentLink1URL: https://www.mouser.de/datasheet/2/445/150060GS75020-1714345.pdf; Component Type: LED Diode; Device Package: 0603; Last Updated: 03.03.2021 09:59:51; Mounting Type: SMD; Operating Temperature: -40 - 85 °C; Supplier 1: Mouser; Supplier Part Number 1: 710-150060GS84000; Supplier 2: Farnell; Supplier Part Number 2: 3408612; Supplier 3: Digi-Key; Supplier Part Number 3: 732-150060GS84000CT-ND; Live Cycle Status: 1; Stock number: not stored; Color: green
L12 L13 = 742792040: as L6 on sheet Power_3; Manufacturer Part Number: 742792040; PartID: 1; Created On: 18.01.2021 14:53:17; ComponentLink1Description: Datasheet; ComponentLink1URL: https://www.mouser.de/datasheet/2/445/742792040-1720361.pdf; Component Type: Inductance; Device Package: 0805; Last Updated: 18.01.2021 14:53:25; Mounting Type: SMD; Operating Temperature: -55 - 125 °C; Series: WE-CBF; Supplier 1: Mouser; Supplier Part Number 1: 710-742792040; Value: 600 Ohm; Live Cycle Status: 1; Stock number: not stored
L14 L15 = B82464G4154M: Inductor SMT, 10 x 10, 150 µH, 0.8 A; Manufacturer: TDK; MF: EPCOS / TDK; DCR: 320m; Rated Current: 0.85 A; DC current: 0.8 A; Created from: MGremer; MPN: B82464G4154M; Supplier 1: Mouser; Supplier Part Number 1: 871-B82464G4154M; Value: 150 µH; Manufacturer Part Number: B82464G4154M; PartID: 5; Created On: 08.06.2021 11:33:39; ComponentLink1Description: Datasheet; ComponentLink1URL: https://www.tdk-electronics.tdk.com/inf/30/db/ind_2008/b82464g4.pdf; Component Type: Inductor; Device Package: 10.4 x 10.4 x 4.8 (mm); Last Updated: 24.08.2021 15:23:28; Mounting Type: SMD; Operating Temperature: -55 - 125 °C; Series: B82464G; Type: Inductor; Live Cycle Status: 1; Stock number: not stored
R20 R42 = CR0603-FX-1623ELF: SMD resistor 1%; Manufacturer: Burns; Created from: MGremer; Manufacturer Part Number: CR0603-FX-1623ELF; PartID: 165; Created On: 14.12.2020 16:17:14; ComponentLink1Description: Datasheet; ComponentLink1URL: https://www.mouser.de/datasheet/2/54/crxxxxx-1858361.pdf; Component Type: SMD resistor; Device Package: 0603; Last Updated: 02.03.2021 14:07:32; Mounting Type: SMD; Supplier 1: Mouser; Supplier Part Number 1: 652-CR0603-FX1623ELF; Type: Resistor; Tolerance: 1%; Value: 162k; Live Cycle Status: 1; Stock number: not stored
R21 R43 = RK73B1JTTD753J: SMD resistor E24 series; Manufacturer: KOA Speer; Tolerance: 5%; Created from: MGremer; Manufacturer Part Number: RK73B1JTTD753J; PartID: 119; Created On: 14.12.2020 16:17:14; ComponentLink1Description: Datasheet; ComponentLink1URL: https://www.mouser.de/datasheet/2/219/RK73B-1825463.pdf; Component Type: SMD resistor; Device Package: 0603; Last Updated: 02.03.2021 14:07:32; Mounting Type: SMD; Supplier 1: Mouser; Supplier Part Number 1: 660-RK73B1JTTD753J; Type: Resistor; Value: 75k; Live Cycle Status: 1; Stock number: Labor SMD Container
R25 R44 = ERJ-P03F1621V: SMD resistor 1%; Manufacturer: Panasonic; Created from: MGremer; Manufacturer Part Number: ERJ-P03F1621V; PartID: 191; Created On: 14.12.2020 16:17:14; ComponentLink1Description: Datasheet; ComponentLink1URL: https://www.mouser.de/datasheet/2/315/AOA0000C331-1141874.pdf; Component Type: SMD resistor; Device Package: 0603; Last Updated: 02.07.2021 11:49:34; Mounting Type: SMD; Supplier 1: Mouser; Supplier Part Number 1: 667-ERJ-P03F1621V; Type: Resistor; Tolerance: 1%; Value: 1k62; Live Cycle Status: 1; Stock number: not stored
R26 R45 = CR0603-FX-1333ELF: SMD resistor 1%; Manufacturer: Burns; Created from: MGremer; Manufacturer Part Number: CR0603-FX-1333ELF; PartID: 166; Created On: 14.12.2020 16:17:14; ComponentLink1Description: Datasheet; ComponentLink1URL: https://www.mouser.de/datasheet/2/54/crxxxxx-1858361.pdf; Component Type: SMD resistor; Device Package: 0603; Last Updated: 02.03.2021 14:07:32; Mounting Type: SMD; Supplier 1: Mouser; Supplier Part Number 1: 652-CR0603FX-1333ELF; Type: Resistor; Tolerance: 1%; Value: 133k; Live Cycle Status: 1; Stock number: not stored
R41 R46 = CR0603-FX-1021ELF: SMD resistor 1%; Manufacturer: Burns; Created from: MGremer; Manufacturer Part Number: CR0603-FX-1021ELF; PartID: 168; Created On: 14.12.2020 16:17:14; ComponentLink1Description: Datasheet; ComponentLink1URL: https://www.mouser.de/datasheet/2/54/crxxxxx-1858361.pdf; Component Type: SMD resistor; Device Package: 0603; Last Updated: 02.03.2021 14:07:32; Mounting Type: SMD; Supplier 1: Mouser; Supplier Part Number 1: 652-CR0603FX-1021ELF; Type: Resistor; Tolerance: 1%; Value: 1k02; Live Cycle Status: 1; Stock number: not stored
R63 = RK73B1JTTD273J: SMD resistor E24 series; Manufacturer: KOA Speer; Tolerance: 5%; Created from: MGremer; Manufacturer Part Number: RK73B1JTTD273J; PartID: 108; Created On: 14.12.2020 16:17:14; ComponentLink1Description: Datasheet; ComponentLink1URL: https://www.mouser.de/datasheet/2/219/RK73B-1825463.pdf; Component Type: SMD resistor; Device Package: 0603; Last Updated: 02.03.2021 14:07:32; Mounting Type: SMD; Supplier 1: Mouser; Supplier Part Number 1: 660-RK73B1JTTD273J; Type: Resistor; Value: 27k; Live Cycle Status: 1; Stock number: Labor SMD Container
R65 = RK73B1JTTD622J: SMD resistor E24 series; Manufacturer: KOA Speer; Tolerance: 5%; Created from: MGremer; Manufacturer Part Number: RK73B1JTTD622J; PartID: 93; Created On: 14.12.2020 16:17:14; ComponentLink1Description: Datasheet; ComponentLink1URL: https://www.mouser.de/datasheet/2/219/RK73B-1825463.pdf; Component Type: SMD resistor; Device Package: 0603; Last Updated: 02.03.2021 14:07:32; Mounting Type: SMD; Supplier 1: Mouser; Supplier Part Number 1: 660-RK73B1JTTD622J; Type: Resistor; Value: 6k2; Live Cycle Status: 1; Stock number: Labor SMD Container
R66 = RK73B1JTTDD102J: SMD resistor E24 series; Manufacturer: KOA Speer; Tolerance: 5%; Created from: MGremer; Manufacturer Part Number: RK73B1JTTDD102J; PartID: 74; Created On: 14.12.2020 16:17:14; ComponentLink1Description: Datasheet; ComponentLink1URL: https://www.mouser.de/datasheet/2/219/RK73B-1825463.pdf; Component Type: SMD resistor; Device Package: 0603; Last Updated: 02.03.2021 14:07:32; Mounting Type: SMD; Supplier 1: Mouser; Supplier Part Number 1: 660-RK73B1JTTDD102J; Type: Resistor; Value: 1k; Live Cycle Status: 1; Stock number: Labor SMD Container
TP17 TP21 TP22 TP25 TP30 = -: as TP7 on sheet Power_3; Created: 2018_06_25_AGeiger; Manufacturer Part Number: -; PartID: 9; Created On: 02.03.2021 14:59:37; ComponentLink1Description: Datasheet; ComponentLink1URL: -; ComponentLink2Description: Homepage; ComponentLink2URL: -; Component Type: Test Point; Device Package: SMD; Last Updated: 08.10.2021 21:16:06; Manufacturer: -; Minimum Order: 1; Mounting Type: SMD; Supplier 1: -; Supplier Part Number 1: -; Type: Test point; Live Cycle Status: 1; Stock number: not stored
U9 U11 = LM5007MM/NOPB: Buck Converter with 80 V integrated Power MOSFET, U_in 9 V - 75 V, U_out 2.5 V - 73 V, I_out 500 mA; Manufacturer: Texas Instruments; Value: 500 mA; Created from: MGremer; Manufacturer Part Number: LM5007MM/NOPB; PartID: 7; Created On: 06.01.2021 09:48:37; ComponentLink1Description: Datasheet; ComponentLink1URL: https://www.ti.com/general/docs/suppproductinfo.tsp?distId=26&gotoUrl=http%3A%2F%2Fwww.ti.com%2Flit%2Fgpn%2Flm5007; Component Type: Buck Converter; Device Package: -; Last Updated: 15.02.2021 10:14:22; Mounting Type: SMD; Series: LM5007; Supplier 1: Mouser; Supplier Part Number 1: 926-LM5007MM/NOPB; Type: Buck Converter; Live Cycle Status: 1; Stock number: not stored

## Sheet IEPE.SchDoc
size A4; CompanyName: TH Nürnberg; Organization: UltraZohm; Address1: Kesslerplatz 12; Address2: 90489 Nürnberg; Address3: GERMANY; SheetNumber: 3; SheetTotal: 10
Used 4 times, as channels IEPE1, IEPE2, IEPE3, IEPE4. Parts and nets are listed once, with the designators drawn on the sheet.
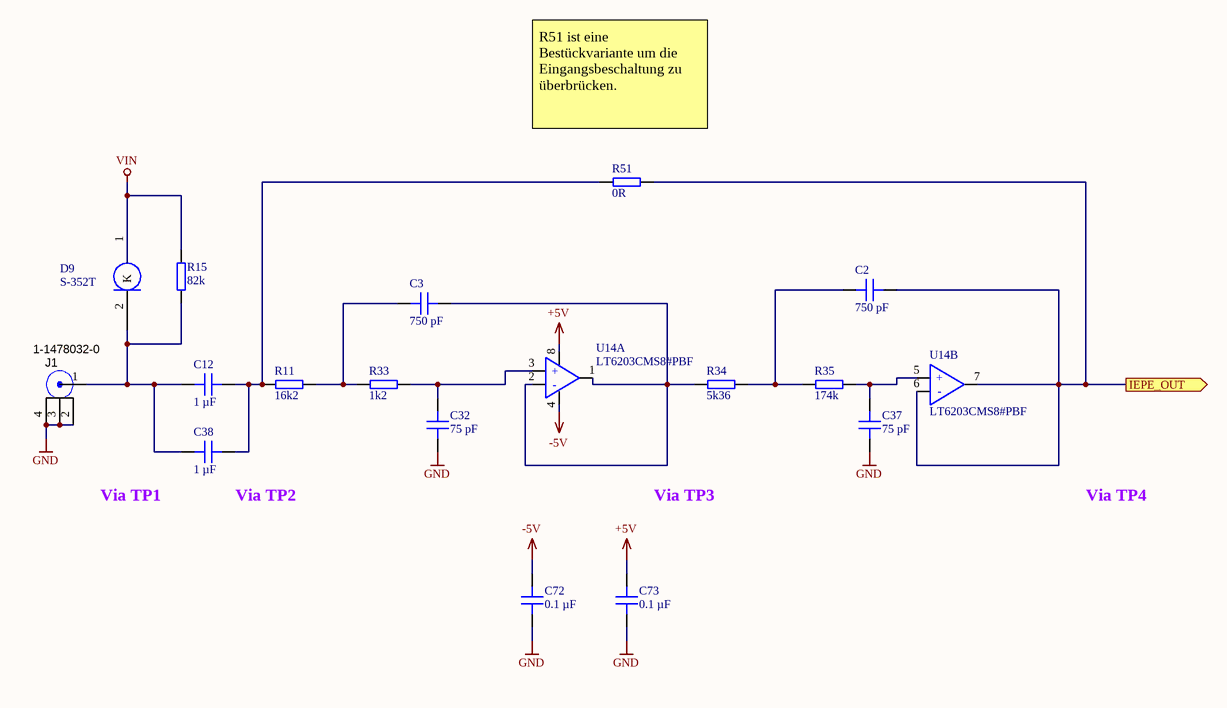
[diagram p9: IEPE.SchDoc]

### Parts
C2  750 pF  [C_0603]
C3  750 pF  [C_0603]
C12  1 µF  [C_0603]
C32  75 pF  [C_0603]
C37  75 pF  [C_0603]
C38  1 µF  [C_0603]
C72  0.1 µF  [C_0603]
C73  0.1 µF  [C_0603]
D9  S-352T  [CRD]
J1  1-1478032-0  [Right Angle BNC]
R11  16k2  [RES 0603_1608]
R15  82k  [RES 0603_1608]
R33  1k2  [RES 0603_1608]
R34  5k36  [RES 0603_1608]
R35  174k  [RES 0603_1608]
R51  0R  [RES 0603_1608]
U14  LT6203CMS8#PBF  [MSOP8_3x3-8N]  (parts A,B of 2)

### Ports
IEPE_OUT (out)

### Nets
+5V: C73.2 U14.8
-5V: C72.2 U14.4
GND: C32.1 C37.1 C72.1 C73.1 J1.2 J1.3 J1.4
VIN: D9.1(A) R15.2
IEPE_OUT: C2.2 R51.2 U14.6(-) U14.7 ; port IEPE_OUT
NetC2_1: C2.1 R34.2 R35.1
NetC3_1: C3.1 R11.2 R33.1
NetC3_2: C3.2 R34.1 U14.1 U14.2(-)
NetC12_1: C12.1 C38.1 D9.2(K) J1.1 R15.1
NetC12_2: C12.2 C38.2 R11.1 R51.1
NetC32_2: C32.2 R33.2 U14.3(+)
NetC37_2: C37.2 R35.2 U14.5(+)

### Channels
IEPE1: designators end in A; ports IEPE_OUT=IEPE_OUT1
IEPE2: designators end in B; ports IEPE_OUT=IEPE_OUT2
IEPE3: designators end in C; ports IEPE_OUT=IEPE_OUT3
IEPE4: designators end in D; ports IEPE_OUT=IEPE_OUT4

### Notes on the sheet
- R51 ist eine Bestückvariante um die Eingangsbeschaltung zu überbrücken.
- (near C38) Via TP1
- (near C38) Via TP2
- Via TP3
- Via TP4
- Title
- Revision:
- Design Engineer:
- Date:
- Project:
- Sheet
- of

### Library data of the parts
C2 C3 = C0603C751J5GACAUTO: Capacitor 0603, 50 VDC, 750 pF, C0G; Manufacturer: KEMET; Tolerance: 5 %; Voltage Rating: 50 VDC; Created from: MGremer; Manufacturer Part Number: C0603C751J5GACAUTO; PartID: 82; Created On: 20.12.2020 13:54:13; ComponentLink1Description: Datasheet; ComponentLink1URL: https://www.mouser.de/datasheet/2/212/KEM_C1022_C0G_AUTO_SMD-1093282.pdf; Component Type: Capacitor 0603; Device Package: 0603; Last Updated: 20.01.2021 13:57:36; Mounting Type: SMD; Operating Temperature: -55 - 125°C; Series: C0G; Supplier 1: Mouser; Supplier Part Number 1: 80-C0603C751J5GAUTO; Type: Capacitor; Value: 750 pF; Live Cycle Status: 1; Stock number: not stored
C12 C38 = UMK107AB7105KA-T: Capacitor 0603, 50 VDC, 1 µF, X7R; Manufacturer: Taiyo Yuden; Tolerance: 10 %; Voltage Rating: 50 VDC; Created from: MGremer; Manufacturer Part Number: UMK107AB7105KA-T; PartID: 5; Created On: 20.12.2020 13:54:13; ComponentLink1Description: Datasheet; ComponentLink1URL: https://www.mouser.de/datasheet/2/396/mlcc02_e-1307760.pdf; Component Type: Capacitor 0603; Device Package: 0603; Last Updated: 20.12.2020 16:42:28; Mounting Type: SMD; Operating Temperature: -55 - 125°C; Series: M; Supplier 1: Mouser; Supplier Part Number 1: 963-UMK107AB7105KA-T; Type: Capacitor; Value: 1 µF; Live Cycle Status: 1; Stock number: Labor SMD Container
C32 C37 = C0603C750J5RACAUTO: Capacitor 0603, 50 VDC, 75 pF, X7R; Manufacturer: KEMET; Tolerance: 5 %; Voltage Rating: 50 VDC; Created from: MGremer; Manufacturer Part Number: C0603C750J5RACAUTO; PartID: 83; Created On: 20.12.2020 13:54:13; ComponentLink1Description: Datasheet; ComponentLink1URL: https://www.mouser.de/datasheet/2/212/KEM_C1023_X7R_AUTO_SMD-1093309.pdf; Component Type: Capacitor 0603; Device Package: 0603; Last Updated: 20.01.2021 13:57:36; Mounting Type: SMD; Operating Temperature: -55 - 125°C; Series: C0G; Supplier 1: Mouser; Supplier Part Number 1: 80-C0603C750J5RAUTO; Type: Capacitor; Value: 75 pF; Live Cycle Status: 1; Stock number: not stored
C72 C73 = C0603X104K5RAC7411: as C31 on sheet Power_3; Manufacturer Part Number: C0603X104K5RAC7411; PartID: 3; Created On: 20.12.2020 13:54:13; ComponentLink1Description: Datasheet; ComponentLink1URL: https://www.mouser.de/datasheet/2/212/1/KEM_C1013_X7R_FT_CAP_SMD-1103280.pdf; Component Type: Capacitor 0603; Device Package: 0603; Last Updated: 04.03.2021 09:24:28; Mounting Type: SMD; Operating Temperature: -55 - 125°C; Series: SMD Comm X7R Flex; Supplier 1: Mouser; Supplier Part Number 1: 80-C0603X104K5R7411; Supplier 2: LCSC; Supplier Part Number 2: C14663; Type: Capacitor; Value: 0.1 µF; Live Cycle Status: 1; LCSC Part Number: C14663; Stock number: Labor SMD Container
D9 = S-352T: Current Regulator Diodes 100V 3.5mA; Manufacturer: Semitec; Type: CRD Diode; Created from: PTurowski; Manufacturer Part Number: S-352T; PartID: 1; Created On: 25.05.2021 10:37:04; ComponentLink1Description: Datasheet; ComponentLink1URL: https://www.mouser.de/datasheet/2/362/P22-23-CRD-1729293.pdf; Component Type: CRD Diode; Last Updated: 25.05.2021 10:37:04; Mounting Type: SMD/SMT; Operating Temperature: -40 to 150 °C; Supplier 1: Mouser; Supplier Part Number 1: 954-S-352T; Live Cycle Status: 1; Stock number: 0
J1 = 1-1478032-0: BNC Connector; Manufacturer: TE; PartNumber: Used in BOM report; SymbolVersion: use current date i.e. 2008-05-20; SymbolCreator: Use LDAP id; CompType: Used in some BOM reports.  Useful for finding later.; U/M: EA, IN, or GM; Created from: FSchoenig, MGremer; MountType: SMT, TH, or N/A; RoHS: Used in BOM report.  Use Y or N.; PackageReference: eg:  0603, used in PnP report; ComponentLink1Description: Datasheet; ComponentLink1URL: https://www.te.com/commerce/DocumentDelivery/DDEController?Action=showdoc&DocId=Data+Sheet%7F6-1773448-5_ZDC_RF_COAX_50-75_OHM%7F1007%7Fpdf%7FEnglish%7FENG_DS_6-1773448-5_ZDC_RF_COAX_50-75_OHM_1007.pdf&src-supplier=Avnet; Alternate PartNumber: -; Alternate Manufacturer: -; Supplier 1: Digi-Key; Supplier Part Number 1: A97560-ND; Manufacturer Part Number: 1-1478032-0; PartID: 3; Created On: 12.05.2021 17:41:04; Component Type: BNC; Device Package: BNC; Last Updated: 24.08.2021 10:46:04; Mounting Type: THT; Type: BNC; Live Cycle Status: 1; Stock number: not stored
R11 = AC0603FR-0716K2L: SMD resistor 1%; Manufacturer: YAGEO; Created from: MGremer; Manufacturer Part Number: AC0603FR-0716K2L; PartID: 194; Created On: 14.12.2020 16:17:14; ComponentLink1Description: Datasheet; ComponentLink1URL: https://www.mouser.de/datasheet/2/447/PYu_AC_51_RoHS_L_7-1714230.pdf; Component Type: SMD resistor; Device Package: 0603; Last Updated: 02.07.2021 11:49:34; Mounting Type: SMD; Supplier 1: Mouser; Supplier Part Number 1: 603-AC0603FR-0716K2L; Type: Resistor; Tolerance: 1%; Value: 16k2; Live Cycle Status: 1; Stock number: not stored
R15 = RK73B1JTTDD823J: SMD resistor E24 series; Manufacturer: KOA Speer; Tolerance: 5%; Created from: MGremer; Manufacturer Part Number: RK73B1JTTDD823J; PartID: 120; Created On: 14.12.2020 16:17:14; ComponentLink1Description: Datasheet; ComponentLink1URL: https://www.mouser.de/datasheet/2/219/RK73B-1825463.pdf; Component Type: SMD resistor; Device Package: 0603; Last Updated: 02.03.2021 14:07:32; Mounting Type: SMD; Supplier 1: Mouser; Supplier Part Number 1: 660-RK73B1JTTDD823J; Type: Resistor; Value: 82k; Live Cycle Status: 1; Stock number: Labor SMD Container
R33 = RK73B1JTTD122J: SMD resistor E24 series; Manufacturer: KOA Speer; Tolerance: 5%; Created from: MGremer; Manufacturer Part Number: RK73B1JTTD122J; PartID: 76; Created On: 14.12.2020 16:17:14; ComponentLink1Description: Datasheet; ComponentLink1URL: https://www.mouser.de/datasheet/2/219/RK73B-1825463.pdf; Component Type: SMD resistor; Device Package: 0603; Last Updated: 02.03.2021 14:07:32; Mounting Type: SMD; Supplier 1: Mouser; Supplier Part Number 1: 660-RK73B1JTTD122J; Type: Resistor; Value: 1k2; Live Cycle Status: 1; Stock number: Labor SMD Container
R34 = AC0603FR-075K36L: SMD resistor 1%; Manufacturer: YAGEO; Created from: MGremer; Manufacturer Part Number: AC0603FR-075K36L; PartID: 195; Created On: 14.12.2020 16:17:14; ComponentLink1Description: Datasheet; ComponentLink1URL: https://www.mouser.de/datasheet/2/447/PYu_AC_51_RoHS_L_7-1714230.pdf; Component Type: SMD resistor; Device Package: 0603; Last Updated: 02.07.2021 11:49:34; Mounting Type: SMD; Supplier 1: Mouser; Supplier Part Number 1: 603-AC0603FR-075K36L; Type: Resistor; Tolerance: 1%; Value: 5k36; Live Cycle Status: 1; Stock number: not stored
R35 = RC0603FR-07174KL: SMD resistor 1%; Manufacturer: YAGEO; Created from: MGremer; Manufacturer Part Number: RC0603FR-07174KL; PartID: 196; Created On: 14.12.2020 16:17:14; ComponentLink1Description: Datasheet; ComponentLink1URL: https://www.mouser.de/datasheet/2/447/Yageo_03_18_2021_PYu_RC_Group_51_RoHS_L_11-2199992.pdf; Component Type: SMD resistor; Device Package: 0603; Last Updated: 02.07.2021 11:49:34; Mounting Type: SMD; Supplier 1: Mouser; Supplier Part Number 1: 603-RC0603FR-07174KL; Type: Resistor; Tolerance: 1%; Value: 174k; Live Cycle Status: 1; Stock number: not stored
R51 = RC0603JR-070RL: as R31 on sheet ADC_Ref; Manufacturer Part Number: RC0603JR-070RL; PartID: 1; Created On: 14.12.2020 16:17:14; ComponentLink1Description: Datasheet; ComponentLink1URL: https://www.mouser.de/datasheet/2/447/PYu-RC_Group_51_RoHS_L_10-1664068.pdf; Component Type: SMD resistor; Device Package: 0603; Last Updated: 04.03.2021 09:09:42; Mounting Type: SMD; Supplier 1: Mouser; Supplier Part Number 1: 603-RC0603JR-070RL; Supplier 2: LCSC; Supplier Part Number 2: C21189; Type: Resistor; Value: 0R; Live Cycle Status: 1; Stock number: Labor SMD Container; LCSC Part Number: C21189
U14 = LT6203CMS8#PBF: Operational Amplifier, Rail-to-Rail, ultralow noise; Manufacturer: Analog Devices; Channels: 2; GBP: 100 MHz; CMRR: 85 dB; Created from: MGremer; Manufacturer Part Number: LT6203CMS8#PBF; PartID: 1; Created On: 15.01.2021 11:55:32; ComponentLink1Description: Datasheet; ComponentLink1URL: https://www.mouser.de/datasheet/2/609/620234fd-1279470.pdf; Component Type: Operational Amplifier; Device Package: MSOP-8; Last Updated: 15.01.2021 12:06:43; Mounting Type: SMD; Operating Temperature: 0 - 70 °C; Supplier 1: Mouser; Supplier Part Number 1: 584-LT6203CMS8#PBF; Type: OPV; Value: Rail-to-Rail; Live Cycle Status: 1; Stock number: not stored